# Altium project Lichtschlag.PrjPCB
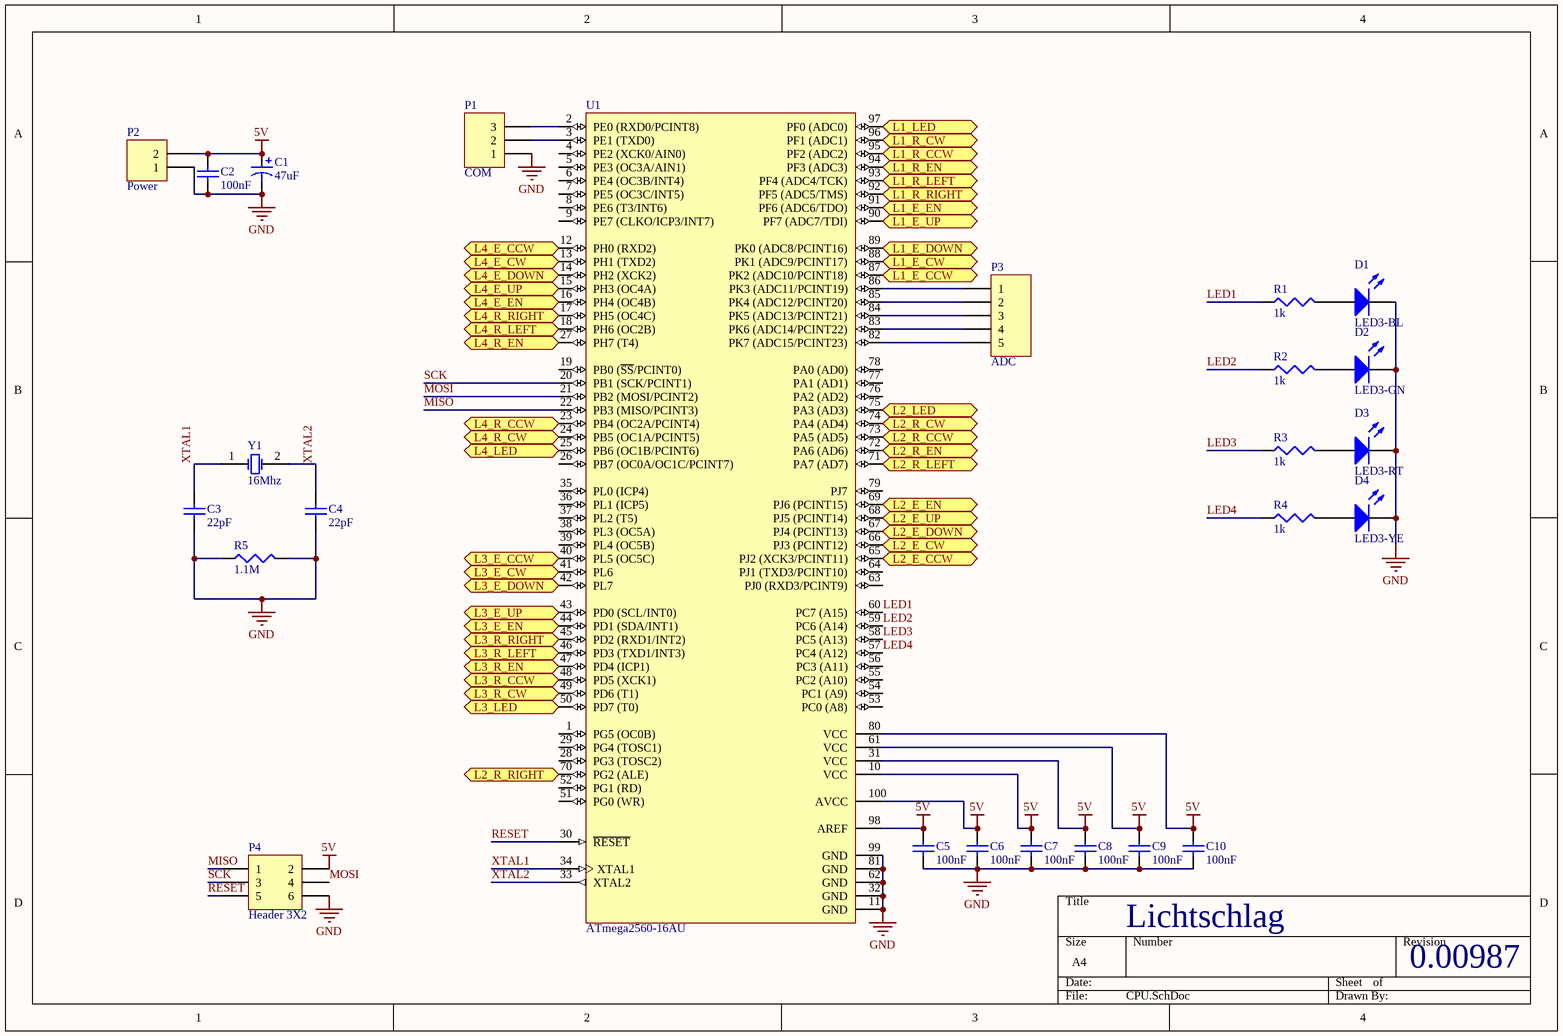
[diagram p0: CPU.SchDoc]
3 sheets, 93 parts. Net scope: flat (ports and power ports of the same name join across sheets).
Board file: Lichtschlag.PcbDoc
Sheets:
  CPU.SchDoc
  Motor1.SchDoc
  Motor2.SchDoc

## Sheet CPU.SchDoc
size A4

### Parts
C1  47uF  [2220]
C2  100nF  [2220]
C3  22pF  [6-0805_N]
C4  22pF  [6-0805_N]
C5  100nF  [2220]
C6  100nF  [2220]
C7  100nF  [2220]
C8  100nF  [2220]
C9  100nF  [2220]
C10  100nF  [2220]
D1  LED3-BL  [6-0805_N]
D2  LED3-GN  [6-0805_N]
D3  LED3-RT  [6-0805_N]
D4  LED3-YE  [6-0805_N]
P1  COM  [HDR1X3]
P2  Power  [HDR1X2]
P3  ADC  [HDR1X5]
P4  Header 3X2  [HDR2X3]
R1  1k  [6-0805_N]
R2  1k  [6-0805_N]
R3  1k  [6-0805_N]
R4  1k  [6-0805_N]
R5  1.1M  [6-0805_N]
U1  ATmega2560-16AU  [100A_M]
Y1  16Mhz  [R38]

### Ports
L1_E_CCW (in), L1_E_CW (in), L1_E_DOWN (out), L1_E_EN (out), L1_E_UP (out), L1_LED (out), L1_R_CCW (in), L1_R_CW (in), L1_R_EN (out), L1_R_LEFT (out), L1_R_RIGHT (out), L2_E_CCW (in), L2_E_CW (in), L2_E_DOWN (out), L2_E_EN (out), L2_E_UP (out), L2_LED (out), L2_R_CCW (in), L2_R_CW (in), L2_R_EN (out), L2_R_LEFT (out), L2_R_RIGHT (out), L3_E_CCW (in), L3_E_CW (in), L3_E_DOWN (out), L3_E_EN (out), L3_E_UP (out), L3_LED (out), L3_R_CCW (in), L3_R_CW (in), L3_R_EN (out), L3_R_LEFT (out), L3_R_RIGHT (out), L4_E_CCW (in), L4_E_CW (in), L4_E_DOWN (out), L4_E_EN (out), L4_E_UP (out), L4_LED (out), L4_R_CCW (in), L4_R_CW (in), L4_R_EN (out), L4_R_LEFT (out), L4_R_RIGHT (out)

### Nets
5V: C1.1 C2.2 C5.2 C6.2 C7.2 C8.2 C9.2 C10.2 P2.2 P4.2 U1.10(VCC) U1.31(VCC) U1.61(VCC) U1.80(VCC) U1.98(AREF) U1.100(AVCC)
GND: C1.2 C2.1 C3.1 C4.1 C5.1 C6.1 C7.1 C8.1 C9.1 C10.1 D1.2(K) D2.2(K) D3.2(K) D4.2(K) P1.1 P2.1 P4.6 R5.1 R5.2 U1.11(GND) U1.32(GND) U1.62(GND) U1.81(GND) U1.99(GND)
LED1: R1.1 U1.60(PC7_(A15))
LED2: R2.1 U1.59(PC6_(A14))
LED3: R3.1 U1.58(PC5_(A13))
LED4: R4.1 U1.57(PC4_(A12))
MISO: P4.1 U1.22(PB3_(MISO/PCINT3))
MOSI: P4.4 U1.21(PB2_(MOSI/PCINT2))
RESET: P4.5 U1.30(~{RESET})
SCK: P4.3 U1.20(PB1_(SCK/PCINT1))
XTAL1: C3.2 U1.34(XTAL1) Y1.1(OSC1)
XTAL2: C4.2 U1.33(XTAL2) Y1.2(OSC2)
NetD1_1: D1.1(A) R1.2
NetD2_1: D2.1(A) R2.2
NetD3_1: D3.1(A) R3.2
NetD4_1: D4.1(A) R4.2
NetP1_2: P1.2 U1.3(PE1_(TXD0))
NetP1_3: P1.3 U1.2(PE0_(RXD0/PCINT8))
NetP3_1: P3.1 U1.86(PK3_(ADC11/PCINT19))
NetP3_2: P3.2 U1.85(PK4_(ADC12/PCINT20))
NetP3_3: P3.3 U1.84(PK5_(ADC13/PCINT21))
NetP3_4: P3.4 U1.83(PK6_(ADC14/PCINT22))
NetP3_5: P3.5 U1.82(PK7_(ADC15/PCINT23))
NetQ1_3: U1.96(PF1_(ADC1)) ; port L1_R_CW
NetQ1_5: U1.95(PF2_(ADC2)) ; port L1_R_CCW
NetQ2_1: U1.94(PF3_(ADC3)) ; port L1_R_EN
NetQ2_2: U1.93(PF4_(ADC4/TCK)) ; port L1_R_LEFT
NetQ2_7: U1.92(PF5_(ADC5/TMS)) ; port L1_R_RIGHT
NetQ2_9: U1.91(PF6_(ADC6/TDO)) ; port L1_E_EN
NetQ2_10: U1.89(PK0_(ADC8/PCINT16)) ; port L1_E_DOWN
NetQ2_15: U1.90(PF7_(ADC7/TDI)) ; port L1_E_UP
NetQ3_3: U1.88(PK1_(ADC9/PCINT17)) ; port L1_E_CW
NetQ3_5: U1.87(PK2_(ADC10/PCINT18)) ; port L1_E_CCW
NetQ5_2: U1.97(PF0_(ADC0)) ; port L1_LED
NetQ6_1: U1.72(PA6_(AD6)) ; port L2_R_EN
NetQ6_2: U1.71(PA7_(AD7)) ; port L2_R_LEFT
NetQ6_7: U1.70(PG2_(ALE)) ; port L2_R_RIGHT
NetQ6_9: U1.69(PJ6_(PCINT15)) ; port L2_E_EN
NetQ6_10: U1.67(PJ4_(PCINT13)) ; port L2_E_DOWN
NetQ6_15: U1.68(PJ5_(PCINT14)) ; port L2_E_UP
NetQ7_3: U1.74(PA4_(AD4)) ; port L2_R_CW
NetQ7_5: U1.73(PA5_(AD5)) ; port L2_R_CCW
NetQ8_3: U1.66(PJ3_(PCINT12)) ; port L2_E_CW
NetQ8_5: U1.65(PJ2_(XCK3/PCINT11)) ; port L2_E_CCW
NetQ10_2: U1.75(PA3_(AD3)) ; port L2_LED
NetQ11_3: U1.49(PD6_(T1)) ; port L3_R_CW
NetQ11_5: U1.48(PD5_(XCK1)) ; port L3_R_CCW
NetQ12_1: U1.47(PD4_(ICP1)) ; port L3_R_EN
NetQ12_2: U1.46(PD3_(TXD1/INT3)) ; port L3_R_LEFT
NetQ12_7: U1.45(PD2_(RXD1/INT2)) ; port L3_R_RIGHT
NetQ12_9: U1.44(PD1_(SDA/INT1)) ; port L3_E_EN
NetQ12_10: U1.42(PL7) ; port L3_E_DOWN
NetQ12_15: U1.43(PD0_(SCL/INT0)) ; port L3_E_UP
NetQ13_3: U1.41(PL6) ; port L3_E_CW
NetQ13_5: U1.40(PL5_(OC5C)) ; port L3_E_CCW
NetQ15_2: U1.50(PD7_(T0)) ; port L3_LED
NetQ16_1: U1.27(PH7_(T4)) ; port L4_R_EN
NetQ16_2: U1.18(PH6_(OC2B)) ; port L4_R_LEFT
NetQ16_7: U1.17(PH5_(OC4C)) ; port L4_R_RIGHT
NetQ16_9: U1.16(PH4_(OC4B)) ; port L4_E_EN
NetQ16_10: U1.14(PH2_(XCK2)) ; port L4_E_DOWN
NetQ16_15: U1.15(PH3_(OC4A)) ; port L4_E_UP
NetQ17_3: U1.24(PB5_(OC1A/PCINT5)) ; port L4_R_CW
NetQ17_5: U1.23(PB4_(OC2A/PCINT4)) ; port L4_R_CCW
NetQ18_3: U1.13(PH1_(TXD2)) ; port L4_E_CW
NetQ18_5: U1.12(PH0_(RXD2)) ; port L4_E_CCW
NetQ20_2: U1.25(PB6_(OC1B/PCINT6)) ; port L4_LED

Not connected (* = marked no-connect by the designer): U1 1(PG5_(OC0B)) 4(PE2_(XCK0/AIN0)) 5(PE3_(OC3A/AIN1)) 6(PE4_(OC3B/INT4)) 7(PE5_(OC3C/INT5)) 8(PE6_(T3/INT6)) 9(PE7_(CLKO/ICP3/INT7)) 19(PB0_(~{SS}/PCINT0)) 26(PB7_(OC0A/OC1C/PCINT7)) 28(PG3_(TOSC2)) 29(PG4_(TOSC1)) 35(PL0_(ICP4)) 36(PL1_(ICP5)) 37(PL2_(T5)) 38(PL3_(OC5A)) 39(PL4_(OC5B)) 51(PG0_(WR)) 52(PG1_(RD)) 53(PC0_(A8)) 54(PC1_(A9)) 55(PC2_(A10)) 56(PC3_(A11)) 63(PJ0_(RXD3/PCINT9)) 64(PJ1_(TXD3/PCINT10)) 76(PA2_(AD2)) 77(PA1_(AD1)) 78(PA0_(AD0)) 79(PJ7)

### Notes on the sheet
- Lichtschlag
- 0.00987

### Library data of the parts
C1 = Cap Pol3: Polarized Capacitor (Surface Mount); Published: 8-Jun-2000; LatestRevisionDate: 29-May-2009; LatestRevisionNote: IPC-7351 Footprint Added.; PackageReference: C0805; Publisher: Altium Limited; PackageDescription: Chip Capacitor; Value: 47uF; Reichelt: https://secure.reichelt.de/Wima-FKS2-FKC2-FKP2/SMD-2220-47N/3//index.html?ACTION=3&GROUPID=3151&ARTICLE=18984&SEARCH=47%20uF%20SMD&OFFSET=16&WKID=0&
C2-C10 = Cap Semi: Capacitor (Semiconductor SIM Model); Published: 8-Jun-2000; LatestRevisionDate: 29-May-2009; LatestRevisionNote: IPC-7351 Footprint Added.; PackageReference: C1206; Publisher: Altium Limited; PackageDescription: Chip Capacitor
  C2 C5-C10: Value: 100nF; Reichelt: https://secure.reichelt.de/Wima-FKS2-FKC2-FKP2/SMD-2220N-100N/3//index.html?ACTION=3&GROUPID=3151&ARTICLE=31415&SEARCH=100%20nF&OFFSET=16&WKID=0&
  C3 C4: Value: 22pF; Reichelt: https://secure.reichelt.de/Vielschicht-SMD-G0805/NPO-G0805-22P/3//index.html?ACTION=3&GROUPID=3165&ARTICLE=13517&SEARCH=22%20pF&OFFSET=16&WKID=0&
D1-D4 = LED3: Typical BLUE SiC LED; Published: 8-Jun-2000; LatestRevisionDate: 17-Dec-2003; LatestRevisionNote: PCB Footprint replaced.; DatasheetVersion: 16-Apr-2002; PackageVersion: 16-Apr-2002; PackageReference: 3.5X2.8X1.9; Publisher: Altium Limited; PackageDescription: SM LED; 2 C-Bend Leads; Body 3.5 x 2.8 x 1.9 mm, inc leads (LxWxH typ)
  D1: Reichelt: https://www.reichelt.de/SMD-LED-0805-BL/3/index.html?&ACTION=3&LA=446&ARTICLE=31438&artnr=SMD-LED+0805+BL&SEARCH=LED+SMD+0805
  D2: Reichelt: https://www.reichelt.de/SMD-LED-0805-GN/3/index.html?&ACTION=3&LA=446&ARTICLE=31436&artnr=SMD-LED+0805+GN&SEARCH=LED+SMD+0805
  D3: Reichelt: https://www.reichelt.de/SMD-LED-0805-RT/3/index.html?&ACTION=3&LA=446&ARTICLE=31435&artnr=SMD-LED+0805+RT&SEARCH=LED+SMD+0805
  D4: Reichelt: https://www.reichelt.de/SMD-LED-0805-GE/3/index.html?&ACTION=3&LA=446&ARTICLE=31437&artnr=SMD-LED+0805+GE&SEARCH=LED+SMD+0805
P1 = Header 3: Header, 3-Pin; LatestRevisionDate: 17-Jul-2002; LatestRevisionNote: Re-released for DXP Platform.; Publisher: Altium Limited
P2 = Header 2: Header, 2-Pin; LatestRevisionDate: 17-Jul-2002; LatestRevisionNote: Re-released for DXP Platform.; Publisher: Altium Limited; Reichelt: https://secure.reichelt.de/RIA-Stecksystem/AKL-101-02/3//index.html?ACTION=3&GROUPID=5754&ARTICLE=36605&SEARCH=AKL%20101-02&OFFSET=16&WKID=0&
P3 = Header 5: Header, 5-Pin; LatestRevisionDate: 17-Jul-2002; LatestRevisionNote: Re-released for DXP Platform.; Publisher: Altium Limited
P4 = Header 3X2: Header, 3-Pin, Dual row; LatestRevisionDate: 17-Jul-2002; LatestRevisionNote: Re-released for DXP Platform.; Publisher: Altium Limited; Reichelt: https://secure.reichelt.de/Pfosten-Wannenstecker/WSL-6G/3//index.html?ACTION=3&GROUPID=3231&ARTICLE=85732&SEARCH=wsl%206g&OFFSET=16&WKID=0&
R1-R5 = Res3: Resistor; Published: 8-Jun-2000; LatestRevisionDate: 29-May-2009; LatestRevisionNote: IPC-7351 Footprint Added.; PackageReference: J1-0603; Publisher: Altium Limited; PackageDescription: Chip Resistor
  R1-R4: Value: 1k; Reichelt: https://secure.reichelt.de/SMD-0-1-0805-1-0-kOhm-9-53-kOhm/SPR-0805-2-21K/3//index.html?ACTION=3&GROUPID=5557&ARTICLE=123267&SEARCH=1k%20SMD%200805&OFFSET=16&WKID=0&
  R5: Value: 1.1M; Reichelt: https://secure.reichelt.de/SMD-0805-1-00-M-Ohm-10-0-M-Ohm/SMD-0805-1-00M/3//index.html?ACTION=3&GROUPID=3100&ARTICLE=32922&SEARCH=1.1%20SMD%200805&OFFSET=16&WKID=0&
U1 = CMP-0095-00210-2: 8-bit AVR Microcontroller, 4.5-5.5V, 16MHz, 256KB Flash, 4KB EEPROM, 8KB SRAM, 86 GPIO pins, 100-pin TQFP, Industrial Grade (-40°C to 85°C), Pb-Free; PackageDescription: 100-Pin Thin Profile Plastic Quad Flat Pack (TQFP), 14 x 14 x 1.0 mm Body, 0.5 mm Pitch; ComponentLink1Description: Manufacturer URL; ComponentLink3URL: http://www.atmel.com/dyn/resources/prod_documents/2549S.pdf; RevisionNote: DatasheetVersion & PackageVersion updated. URLs added.; DatasheetVersion: revN, May-2011; ComponentLink2Description: ATmega640/1280/1281/2560/2561 Datasheet; PackageReference: 100A; PackageVersion: revD, Oct-2010; Code_JEDEC: MS-026-AED; ComponentLink1URL: http://www.atmel.com/; ComponentLink2URL: http://www.atmel.com/dyn/resources/prod_documents/doc2549.pdf; ComponentLink3Description: ATmega640/1280/1281/2560/2561 Summary; Reichelt: https://secure.reichelt.de/Atmel-ATMega-AVRs/ATMEGA-2560-16AU/3//index.html?ACTION=3&GROUPID=2959&ARTICLE=68178&SEARCH=ATMEGA%202560-16AU&OFFSET=16&WKID=0&
Y1 = XTAL: Crystal Oscillator; Published: 8-Jun-2000; LatestRevisionDate: 17-Jul-2002; LatestRevisionNote: Re-released for DXP Platform.; PackageReference: R38; Publisher: Altium Limited; PackageDescription: Crystal, Thru-Hole; 2 Leads; Body 3.1 x 8.2 mm (Dia.xH); Reichelt: https://secure.reichelt.de/Quarze/16-0000-HC49U-S/3//index.html?ACTION=3&GROUPID=3173&ARTICLE=32852&SEARCH=Quarze&OFFSET=16&WKID=0&

## Sheet Motor1.SchDoc
size A4
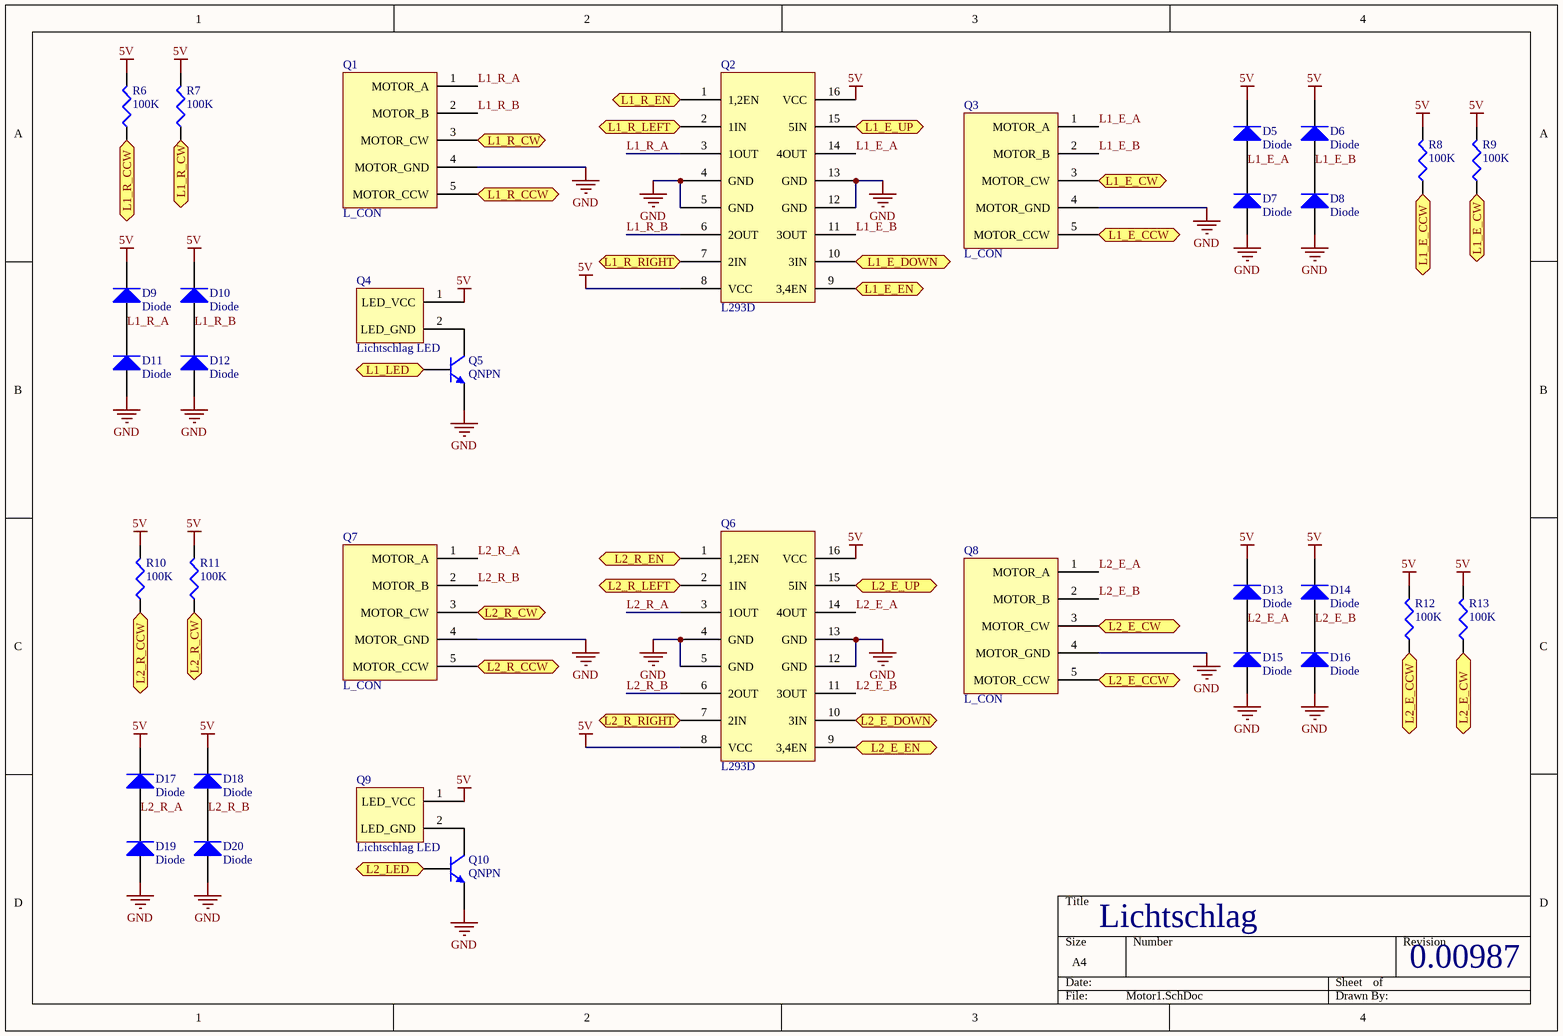
[diagram p1: Motor1.SchDoc]

### Parts
D5  Diode  [3.5X2.8X1.9]
D6  Diode  [3.5X2.8X1.9]
D7  Diode  [3.5X2.8X1.9]
D8  Diode  [3.5X2.8X1.9]
D9  Diode  [3.5X2.8X1.9]
D10  Diode  [3.5X2.8X1.9]
D11  Diode  [3.5X2.8X1.9]
D12  Diode  [3.5X2.8X1.9]
D13  Diode  [3.5X2.8X1.9]
D14  Diode  [3.5X2.8X1.9]
D15  Diode  [3.5X2.8X1.9]
D16  Diode  [3.5X2.8X1.9]
D17  Diode  [3.5X2.8X1.9]
D18  Diode  [3.5X2.8X1.9]
D19  Diode  [3.5X2.8X1.9]
D20  Diode  [3.5X2.8X1.9]
Q1  L_CON  [Lichschlag Connector]
Q2  L293D  [L293D]
Q3  L_CON  [Lichschlag Connector]
Q4  Lichtschlag LED  [Lichtschlag LED]
Q5  QNPN  [SOT-23B_L]
Q6  L293D  [L293D]
Q7  L_CON  [Lichschlag Connector]
Q8  L_CON  [Lichschlag Connector]
Q9  Lichtschlag LED  [Lichtschlag LED]
Q10  QNPN  [SOT-23B_L]
R6  100K  [6-0805_N]
R7  100K  [6-0805_N]
R8  100K  [6-0805_N]
R9  100K  [6-0805_N]
R10  100K  [6-0805_N]
R11  100K  [6-0805_N]
R12  100K  [6-0805_N]
R13  100K  [6-0805_N]

### Ports
L1_E_CCW (out), L1_E_CW (out), L1_E_DOWN (in), L1_E_EN (in), L1_E_UP (in), L1_LED (in), L1_R_CCW (out), L1_R_CW (out), L1_R_EN (in), L1_R_LEFT (in), L1_R_RIGHT (in), L2_E_CCW (out), L2_E_CW (out), L2_E_DOWN (in), L2_E_EN (in), L2_E_UP (in), L2_LED (in), L2_R_CCW (out), L2_R_CW (out), L2_R_EN (in), L2_R_LEFT (in), L2_R_RIGHT (in)

### Nets
5V: D5.2(K) D6.2(K) D9.2(K) D10.2(K) D13.2(K) D14.2(K) D17.2(K) D18.2(K) Q2.8(VCC) Q2.16(VCC) Q4.1(LED_VCC) Q6.8(VCC) Q6.16(VCC) Q9.1(LED_VCC) R6.2 R7.2 R8.2 R9.2 R10.2 R11.2 R12.2 R13.2
GND: D7.1(A) D8.1(A) D11.1(A) D12.1(A) D15.1(A) D16.1(A) D19.1(A) D20.1(A) Q1.4(MOTOR_GND) Q2.4(GND) Q2.5(GND) Q2.12(GND) Q2.13(GND) Q3.4(MOTOR_GND) Q5.3(E) Q6.4(GND) Q6.5(GND) Q6.12(GND) Q6.13(GND) Q7.4(MOTOR_GND) Q8.4(MOTOR_GND) Q10.3(E)
L1_E_A: D5.1(A) D7.2(K) Q2.14(4OUT) Q3.1(MOTOR_A)
L1_E_B: D6.1(A) D8.2(K) Q2.11(3OUT) Q3.2(MOTOR_B)
L1_R_A: D9.1(A) D11.2(K) Q1.1(MOTOR_A) Q2.3(1OUT)
L1_R_B: D10.1(A) D12.2(K) Q1.2(MOTOR_B) Q2.6(2OUT)
L2_E_A: D13.1(A) D15.2(K) Q6.14(4OUT) Q8.1(MOTOR_A)
L2_E_B: D14.1(A) D16.2(K) Q6.11(3OUT) Q8.2(MOTOR_B)
L2_R_A: D17.1(A) D19.2(K) Q6.3(1OUT) Q7.1(MOTOR_A)
L2_R_B: D18.1(A) D20.2(K) Q6.6(2OUT) Q7.2(MOTOR_B)
NetQ1_3: Q1.3(MOTOR_CW) R7.1 ; port L1_R_CW
NetQ1_5: Q1.5(MOTOR_CCW) R6.1 ; port L1_R_CCW
NetQ2_1: Q2.1(1,2EN) ; port L1_R_EN
NetQ2_2: Q2.2(1IN) ; port L1_R_LEFT
NetQ2_7: Q2.7(2IN) ; port L1_R_RIGHT
NetQ2_9: Q2.9(3,4EN) ; port L1_E_EN
NetQ2_10: Q2.10(3IN) ; port L1_E_DOWN
NetQ2_15: Q2.15(5IN) ; port L1_E_UP
NetQ3_3: Q3.3(MOTOR_CW) R9.1 ; port L1_E_CW
NetQ3_5: Q3.5(MOTOR_CCW) R8.1 ; port L1_E_CCW
NetQ4_2: Q4.2(LED_GND) Q5.1(C)
NetQ5_2: Q5.2(B) ; port L1_LED
NetQ6_1: Q6.1(1,2EN) ; port L2_R_EN
NetQ6_2: Q6.2(1IN) ; port L2_R_LEFT
NetQ6_7: Q6.7(2IN) ; port L2_R_RIGHT
NetQ6_9: Q6.9(3,4EN) ; port L2_E_EN
NetQ6_10: Q6.10(3IN) ; port L2_E_DOWN
NetQ6_15: Q6.15(5IN) ; port L2_E_UP
NetQ7_3: Q7.3(MOTOR_CW) R11.1 ; port L2_R_CW
NetQ7_5: Q7.5(MOTOR_CCW) R10.1 ; port L2_R_CCW
NetQ8_3: Q8.3(MOTOR_CW) R13.1 ; port L2_E_CW
NetQ8_5: Q8.5(MOTOR_CCW) R12.1 ; port L2_E_CCW
NetQ9_2: Q9.2(LED_GND) Q10.1(C)
NetQ10_2: Q10.2(B) ; port L2_LED

### Notes on the sheet
- Lichtschlag
- 0.00987

### Library data of the parts
D5-D20 = Diode: Default Diode; Published: 8-Jun-2000; LatestRevisionDate: 17-Jul-2002; LatestRevisionNote: Re-released for DXP Platform.; PackageVersion: Sep-1996; PackageReference: SMC; Publisher: Altium Limited; PackageDescription: DO-214-AB/SMC; 2 C-Bend Leads; Body 7.9 x 5.9 mm, inc. leads (LxW); Code_JEDEC: DO-214-AB; Reichelt: https://secure.reichelt.de/1N-UF-AA-Dioden/1N-4148-SMD/3//index.html?ACTION=3&GROUPID=2987&ARTICLE=18403&SEARCH=diode%20SMD&OFFSET=16&WKID=0&
Q1 Q3 Q7 Q8 = Lichtschlag Connector
Q2 Q6 = L293D: H-Bridge
Q4 Q9 = Lichtschlag LED: NPN General Purpose Amplifier
Q5 Q10 = QNPN: NPN Bipolar Transistor; Published: 8-Jun-2000; LatestRevisionDate: 29-May-2009; LatestRevisionNote: IPC-7351 Footprint Added.; PackageVersion: Aug-1999; PackageReference: SOT-23B; Publisher: Altium Limited; PackageDescription: 3-Pin SOT-23 Package 0.95 mm Pitch, 2.4 mm Lead Span; Reichelt: https://secure.reichelt.de/BC-Transistoren/BC-848A-SMD/3//index.html?ACTION=3&GROUPID=2881&ARTICLE=18564&SEARCH=NPN%20SMD&OFFSET=16&WKID=0&
R6-R13 = Res3: Resistor; Published: 8-Jun-2000; LatestRevisionDate: 29-May-2009; LatestRevisionNote: IPC-7351 Footprint Added.; PackageReference: J1-0603; Publisher: Altium Limited; PackageDescription: Chip Resistor; Value: 100K; Reichelt: https://secure.reichelt.de/SMD-0805-100-k-Ohm-820-k-Ohm/SMD-0805-100K/3//index.html?ACTION=3&GROUPID=3099&ARTICLE=32910&SEARCH=100k%20SMD%200805&OFFSET=16&WKID=0&

## Sheet Motor2.SchDoc
size A4
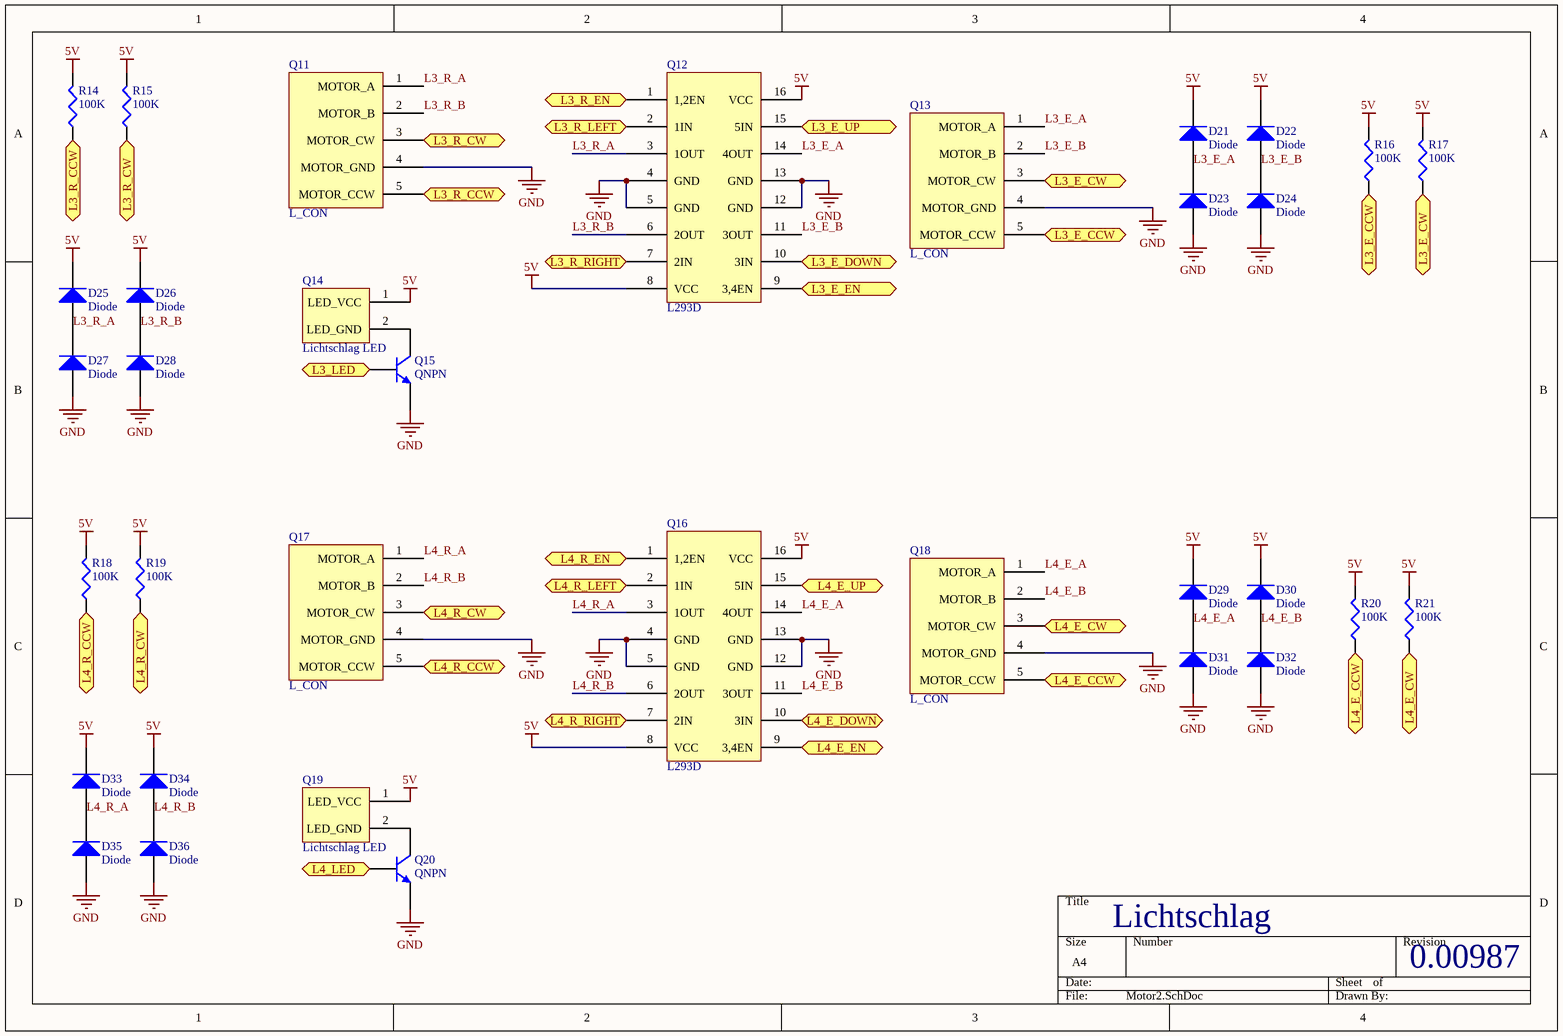
[diagram p2: Motor2.SchDoc]

### Parts
D21  Diode  [3.5X2.8X1.9]
D22  Diode  [3.5X2.8X1.9]
D23  Diode  [3.5X2.8X1.9]
D24  Diode  [3.5X2.8X1.9]
D25  Diode  [3.5X2.8X1.9]
D26  Diode  [3.5X2.8X1.9]
D27  Diode  [3.5X2.8X1.9]
D28  Diode  [3.5X2.8X1.9]
D29  Diode  [3.5X2.8X1.9]
D30  Diode  [3.5X2.8X1.9]
D31  Diode  [3.5X2.8X1.9]
D32  Diode  [3.5X2.8X1.9]
D33  Diode  [3.5X2.8X1.9]
D34  Diode  [3.5X2.8X1.9]
D35  Diode  [3.5X2.8X1.9]
D36  Diode  [3.5X2.8X1.9]
Q11  L_CON  [Lichschlag Connector]
Q12  L293D  [L293D]
Q13  L_CON  [Lichschlag Connector]
Q14  Lichtschlag LED  [Lichtschlag LED]
Q15  QNPN  [SOT-23B_L]
Q16  L293D  [L293D]
Q17  L_CON  [Lichschlag Connector]
Q18  L_CON  [Lichschlag Connector]
Q19  Lichtschlag LED  [Lichtschlag LED]
Q20  QNPN  [SOT-23B_L]
R14  100K  [6-0805_N]
R15  100K  [6-0805_N]
R16  100K  [6-0805_N]
R17  100K  [6-0805_N]
R18  100K  [6-0805_N]
R19  100K  [6-0805_N]
R20  100K  [6-0805_N]
R21  100K  [6-0805_N]

### Ports
L3_E_CCW (out), L3_E_CW (out), L3_E_DOWN (in), L3_E_EN (in), L3_E_UP (in), L3_LED (in), L3_R_CCW (out), L3_R_CW (out), L3_R_EN (in), L3_R_LEFT (in), L3_R_RIGHT (in), L4_E_CCW (out), L4_E_CW (out), L4_E_DOWN (in), L4_E_EN (in), L4_E_UP (in), L4_LED (in), L4_R_CCW (out), L4_R_CW (out), L4_R_EN (in), L4_R_LEFT (in), L4_R_RIGHT (in)

### Nets
5V: D21.2(K) D22.2(K) D25.2(K) D26.2(K) D29.2(K) D30.2(K) D33.2(K) D34.2(K) Q12.8(VCC) Q12.16(VCC) Q14.1(LED_VCC) Q16.8(VCC) Q16.16(VCC) Q19.1(LED_VCC) R14.2 R15.2 R16.2 R17.2 R18.2 R19.2 R20.2 R21.2
GND: D23.1(A) D24.1(A) D27.1(A) D28.1(A) D31.1(A) D32.1(A) D35.1(A) D36.1(A) Q11.4(MOTOR_GND) Q12.4(GND) Q12.5(GND) Q12.12(GND) Q12.13(GND) Q13.4(MOTOR_GND) Q15.3(E) Q16.4(GND) Q16.5(GND) Q16.12(GND) Q16.13(GND) Q17.4(MOTOR_GND) Q18.4(MOTOR_GND) Q20.3(E)
L3_E_A: D21.1(A) D23.2(K) Q12.14(4OUT) Q13.1(MOTOR_A)
L3_E_B: D22.1(A) D24.2(K) Q12.11(3OUT) Q13.2(MOTOR_B)
L3_R_A: D25.1(A) D27.2(K) Q11.1(MOTOR_A) Q12.3(1OUT)
L3_R_B: D26.1(A) D28.2(K) Q11.2(MOTOR_B) Q12.6(2OUT)
L4_E_A: D29.1(A) D31.2(K) Q16.14(4OUT) Q18.1(MOTOR_A)
L4_E_B: D30.1(A) D32.2(K) Q16.11(3OUT) Q18.2(MOTOR_B)
L4_R_A: D33.1(A) D35.2(K) Q16.3(1OUT) Q17.1(MOTOR_A)
L4_R_B: D34.1(A) D36.2(K) Q16.6(2OUT) Q17.2(MOTOR_B)
NetQ11_3: Q11.3(MOTOR_CW) R15.1 ; port L3_R_CW
NetQ11_5: Q11.5(MOTOR_CCW) R14.1 ; port L3_R_CCW
NetQ12_1: Q12.1(1,2EN) ; port L3_R_EN
NetQ12_2: Q12.2(1IN) ; port L3_R_LEFT
NetQ12_7: Q12.7(2IN) ; port L3_R_RIGHT
NetQ12_9: Q12.9(3,4EN) ; port L3_E_EN
NetQ12_10: Q12.10(3IN) ; port L3_E_DOWN
NetQ12_15: Q12.15(5IN) ; port L3_E_UP
NetQ13_3: Q13.3(MOTOR_CW) R17.1 ; port L3_E_CW
NetQ13_5: Q13.5(MOTOR_CCW) R16.1 ; port L3_E_CCW
NetQ14_2: Q14.2(LED_GND) Q15.1(C)
NetQ15_2: Q15.2(B) ; port L3_LED
NetQ16_1: Q16.1(1,2EN) ; port L4_R_EN
NetQ16_2: Q16.2(1IN) ; port L4_R_LEFT
NetQ16_7: Q16.7(2IN) ; port L4_R_RIGHT
NetQ16_9: Q16.9(3,4EN) ; port L4_E_EN
NetQ16_10: Q16.10(3IN) ; port L4_E_DOWN
NetQ16_15: Q16.15(5IN) ; port L4_E_UP
NetQ17_3: Q17.3(MOTOR_CW) R19.1 ; port L4_R_CW
NetQ17_5: Q17.5(MOTOR_CCW) R18.1 ; port L4_R_CCW
NetQ18_3: Q18.3(MOTOR_CW) R21.1 ; port L4_E_CW
NetQ18_5: Q18.5(MOTOR_CCW) R20.1 ; port L4_E_CCW
NetQ19_2: Q19.2(LED_GND) Q20.1(C)
NetQ20_2: Q20.2(B) ; port L4_LED

### Notes on the sheet
- Lichtschlag
- 0.00987

### Library data of the parts
D21-D36 = Diode: Default Diode; Published: 8-Jun-2000; LatestRevisionDate: 17-Jul-2002; LatestRevisionNote: Re-released for DXP Platform.; PackageVersion: Sep-1996; PackageReference: SMC; Publisher: Altium Limited; PackageDescription: DO-214-AB/SMC; 2 C-Bend Leads; Body 7.9 x 5.9 mm, inc. leads (LxW); Code_JEDEC: DO-214-AB; Reichelt: https://secure.reichelt.de/1N-UF-AA-Dioden/1N-4148-SMD/3//index.html?ACTION=3&GROUPID=2987&ARTICLE=18403&SEARCH=diode%20SMD&OFFSET=16&WKID=0&
Q11 Q13 Q17 Q18 = Lichtschlag Connector
Q12 Q16 = L293D: H-Bridge
Q14 Q19 = Lichtschlag LED: NPN General Purpose Amplifier
Q15 Q20 = QNPN: NPN Bipolar Transistor; Published: 8-Jun-2000; LatestRevisionDate: 29-May-2009; LatestRevisionNote: IPC-7351 Footprint Added.; PackageVersion: Aug-1999; PackageReference: SOT-23B; Publisher: Altium Limited; PackageDescription: 3-Pin SOT-23 Package 0.95 mm Pitch, 2.4 mm Lead Span; Reichelt: https://secure.reichelt.de/BC-Transistoren/BC-848A-SMD/3//index.html?ACTION=3&GROUPID=2881&ARTICLE=18564&SEARCH=NPN%20SMD&OFFSET=16&WKID=0&
R14-R21 = Res3: Resistor; Published: 8-Jun-2000; LatestRevisionDate: 29-May-2009; LatestRevisionNote: IPC-7351 Footprint Added.; PackageReference: J1-0603; Publisher: Altium Limited; PackageDescription: Chip Resistor; Value: 100K; Reichelt: https://secure.reichelt.de/SMD-0805-100-k-Ohm-820-k-Ohm/SMD-0805-100K/3//index.html?ACTION=3&GROUPID=3099&ARTICLE=32910&SEARCH=100k%20SMD%200805&OFFSET=16&WKID=0&

## Nets that join several sheets
5V: CPU (16 pins), Motor1 (22 pins), Motor2 (22 pins)
GND: CPU (24 pins), Motor1 (22 pins), Motor2 (22 pins)
NetQ1_3: CPU (U1.96), Motor1 (Q1.3 R7.1)
NetQ1_5: CPU (U1.95), Motor1 (Q1.5 R6.1)
NetQ2_1: CPU (U1.94), Motor1 (Q2.1)
NetQ2_2: CPU (U1.93), Motor1 (Q2.2)
NetQ2_7: CPU (U1.92), Motor1 (Q2.7)
NetQ2_9: CPU (U1.91), Motor1 (Q2.9)
NetQ2_10: CPU (U1.89), Motor1 (Q2.10)
NetQ2_15: CPU (U1.90), Motor1 (Q2.15)
NetQ3_3: CPU (U1.88), Motor1 (Q3.3 R9.1)
NetQ3_5: CPU (U1.87), Motor1 (Q3.5 R8.1)
NetQ5_2: CPU (U1.97), Motor1 (Q5.2)
NetQ6_1: CPU (U1.72), Motor1 (Q6.1)
NetQ6_2: CPU (U1.71), Motor1 (Q6.2)
NetQ6_7: CPU (U1.70), Motor1 (Q6.7)
NetQ6_9: CPU (U1.69), Motor1 (Q6.9)
NetQ6_10: CPU (U1.67), Motor1 (Q6.10)
NetQ6_15: CPU (U1.68), Motor1 (Q6.15)
NetQ7_3: CPU (U1.74), Motor1 (Q7.3 R11.1)
NetQ7_5: CPU (U1.73), Motor1 (Q7.5 R10.1)
NetQ8_3: CPU (U1.66), Motor1 (Q8.3 R13.1)
NetQ8_5: CPU (U1.65), Motor1 (Q8.5 R12.1)
NetQ10_2: CPU (U1.75), Motor1 (Q10.2)
NetQ11_3: CPU (U1.49), Motor2 (Q11.3 R15.1)
NetQ11_5: CPU (U1.48), Motor2 (Q11.5 R14.1)
NetQ12_1: CPU (U1.47), Motor2 (Q12.1)
NetQ12_2: CPU (U1.46), Motor2 (Q12.2)
NetQ12_7: CPU (U1.45), Motor2 (Q12.7)
NetQ12_9: CPU (U1.44), Motor2 (Q12.9)
NetQ12_10: CPU (U1.42), Motor2 (Q12.10)
NetQ12_15: CPU (U1.43), Motor2 (Q12.15)
NetQ13_3: CPU (U1.41), Motor2 (Q13.3 R17.1)
NetQ13_5: CPU (U1.40), Motor2 (Q13.5 R16.1)
NetQ15_2: CPU (U1.50), Motor2 (Q15.2)
NetQ16_1: CPU (U1.27), Motor2 (Q16.1)
NetQ16_2: CPU (U1.18), Motor2 (Q16.2)
NetQ16_7: CPU (U1.17), Motor2 (Q16.7)
NetQ16_9: CPU (U1.16), Motor2 (Q16.9)
NetQ16_10: CPU (U1.14), Motor2 (Q16.10)
NetQ16_15: CPU (U1.15), Motor2 (Q16.15)
NetQ17_3: CPU (U1.24), Motor2 (Q17.3 R19.1)
NetQ17_5: CPU (U1.23), Motor2 (Q17.5 R18.1)
NetQ18_3: CPU (U1.13), Motor2 (Q18.3 R21.1)
NetQ18_5: CPU (U1.12), Motor2 (Q18.5 R20.1)
NetQ20_2: CPU (U1.25), Motor2 (Q20.2)